# EAGLE schematic DBS (EAGLE 9.6.1)
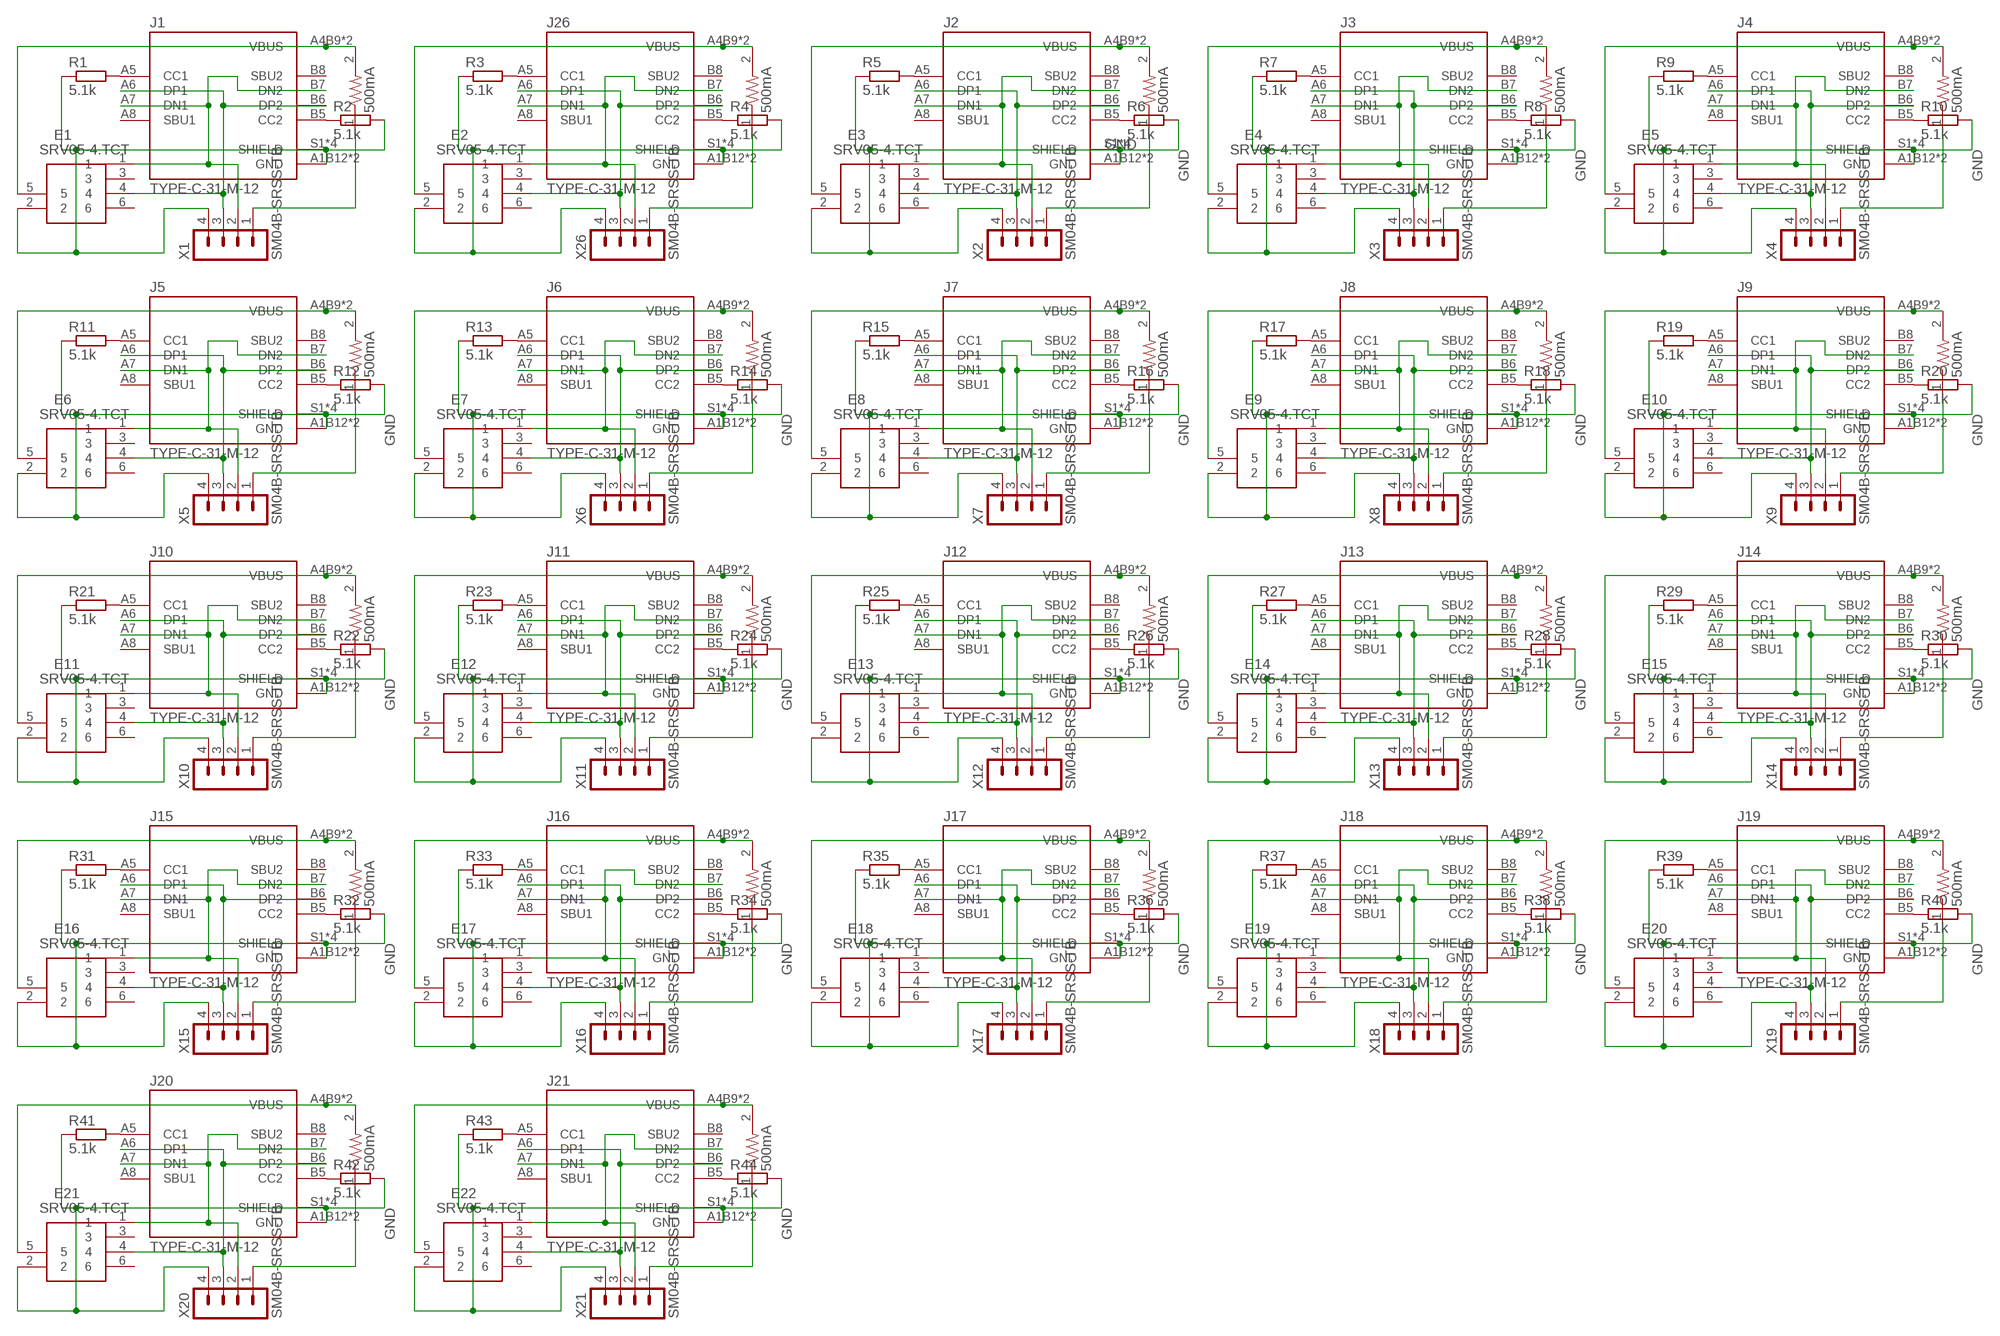
[diagram p0: schematic, sheet 1]

## Parts
E1  SRV05-4.TCT  [SOT95P280X145-6N]
E2  SRV05-4.TCT  [SOT95P280X145-6N]
E3  SRV05-4.TCT  [SOT95P280X145-6N]
E4  SRV05-4.TCT  [SOT95P280X145-6N]
E5  SRV05-4.TCT  [SOT95P280X145-6N]
E6  SRV05-4.TCT  [SOT95P280X145-6N]
E7  SRV05-4.TCT  [SOT95P280X145-6N]
E8  SRV05-4.TCT  [SOT95P280X145-6N]
E9  SRV05-4.TCT  [SOT95P280X145-6N]
E10  SRV05-4.TCT  [SOT95P280X145-6N]
E11  SRV05-4.TCT  [SOT95P280X145-6N]
E12  SRV05-4.TCT  [SOT95P280X145-6N]
E13  SRV05-4.TCT  [SOT95P280X145-6N]
E14  SRV05-4.TCT  [SOT95P280X145-6N]
E15  SRV05-4.TCT  [SOT95P280X145-6N]
E16  SRV05-4.TCT  [SOT95P280X145-6N]
E17  SRV05-4.TCT  [SOT95P280X145-6N]
E18  SRV05-4.TCT  [SOT95P280X145-6N]
E19  SRV05-4.TCT  [SOT95P280X145-6N]
E20  SRV05-4.TCT  [SOT95P280X145-6N]
E21  SRV05-4.TCT  [SOT95P280X145-6N]
E22  SRV05-4.TCT  [SOT95P280X145-6N]
F1  500mA  0ZCJ0075AF2E  [RESC3216X125N]
F2  500mA  0ZCJ0075AF2E  [RESC3216X125N]
F3  500mA  0ZCJ0075AF2E  [RESC3216X125N]
F4  500mA  0ZCJ0075AF2E  [RESC3216X125N]
F5  500mA  0ZCJ0075AF2E  [RESC3216X125N]
F6  500mA  0ZCJ0075AF2E  [RESC3216X125N]
F7  500mA  0ZCJ0075AF2E  [RESC3216X125N]
F8  500mA  0ZCJ0075AF2E  [RESC3216X125N]
F9  500mA  0ZCJ0075AF2E  [RESC3216X125N]
F10  500mA  0ZCJ0075AF2E  [RESC3216X125N]
F11  500mA  0ZCJ0075AF2E  [RESC3216X125N]
F12  500mA  0ZCJ0075AF2E  [RESC3216X125N]
F13  500mA  0ZCJ0075AF2E  [RESC3216X125N]
F14  500mA  0ZCJ0075AF2E  [RESC3216X125N]
F15  500mA  0ZCJ0075AF2E  [RESC3216X125N]
F16  500mA  0ZCJ0075AF2E  [RESC3216X125N]
F17  500mA  0ZCJ0075AF2E  [RESC3216X125N]
F18  500mA  0ZCJ0075AF2E  [RESC3216X125N]
F19  500mA  0ZCJ0075AF2E  [RESC3216X125N]
F20  500mA  0ZCJ0075AF2E  [RESC3216X125N]
F21  500mA  0ZCJ0075AF2E  [RESC3216X125N]
F22  500mA  0ZCJ0075AF2E  [RESC3216X125N]
J1  TYPE-C-31-M-12  [HRO_TYPE-C-31-M-12]
J2  TYPE-C-31-M-12  [HRO_TYPE-C-31-M-12]
J3  TYPE-C-31-M-12  [HRO_TYPE-C-31-M-12]
J4  TYPE-C-31-M-12  [HRO_TYPE-C-31-M-12]
J5  TYPE-C-31-M-12  [HRO_TYPE-C-31-M-12]
J6  TYPE-C-31-M-12  [HRO_TYPE-C-31-M-12]
J7  TYPE-C-31-M-12  [HRO_TYPE-C-31-M-12]
J8  TYPE-C-31-M-12  [HRO_TYPE-C-31-M-12]
J9  TYPE-C-31-M-12  [HRO_TYPE-C-31-M-12]
J10  TYPE-C-31-M-12  [HRO_TYPE-C-31-M-12]
J11  TYPE-C-31-M-12  [HRO_TYPE-C-31-M-12]
J12  TYPE-C-31-M-12  [HRO_TYPE-C-31-M-12]
J13  TYPE-C-31-M-12  [HRO_TYPE-C-31-M-12]
J14  TYPE-C-31-M-12  [HRO_TYPE-C-31-M-12]
J15  TYPE-C-31-M-12  [HRO_TYPE-C-31-M-12]
J16  TYPE-C-31-M-12  [HRO_TYPE-C-31-M-12]
J17  TYPE-C-31-M-12  [HRO_TYPE-C-31-M-12]
J18  TYPE-C-31-M-12  [HRO_TYPE-C-31-M-12]
J19  TYPE-C-31-M-12  [HRO_TYPE-C-31-M-12]
J20  TYPE-C-31-M-12  [HRO_TYPE-C-31-M-12]
J21  TYPE-C-31-M-12  [HRO_TYPE-C-31-M-12]
J26  TYPE-C-31-M-12  [HRO_TYPE-C-31-M-12]
R1  5.1k  RESISTOR-0603  [R0603]
R2  5.1k  RESISTOR-0603  [R0603]
R3  5.1k  RESISTOR-0603  [R0603]
R4  5.1k  RESISTOR-0603  [R0603]
R5  5.1k  RESISTOR-0603  [R0603]
R6  5.1k  RESISTOR-0603  [R0603]
R7  5.1k  RESISTOR-0603  [R0603]
R8  5.1k  RESISTOR-0603  [R0603]
R9  5.1k  RESISTOR-0603  [R0603]
R10  5.1k  RESISTOR-0603  [R0603]
R11  5.1k  RESISTOR-0603  [R0603]
R12  5.1k  RESISTOR-0603  [R0603]
R13  5.1k  RESISTOR-0603  [R0603]
R14  5.1k  RESISTOR-0603  [R0603]
R15  5.1k  RESISTOR-0603  [R0603]
R16  5.1k  RESISTOR-0603  [R0603]
R17  5.1k  RESISTOR-0603  [R0603]
R18  5.1k  RESISTOR-0603  [R0603]
R19  5.1k  RESISTOR-0603  [R0603]
R20  5.1k  RESISTOR-0603  [R0603]
R21  5.1k  RESISTOR-0603  [R0603]
R22  5.1k  RESISTOR-0603  [R0603]
R23  5.1k  RESISTOR-0603  [R0603]
R24  5.1k  RESISTOR-0603  [R0603]
R25  5.1k  RESISTOR-0603  [R0603]
R26  5.1k  RESISTOR-0603  [R0603]
R27  5.1k  RESISTOR-0603  [R0603]
R28  5.1k  RESISTOR-0603  [R0603]
R29  5.1k  RESISTOR-0603  [R0603]
R30  5.1k  RESISTOR-0603  [R0603]
R31  5.1k  RESISTOR-0603  [R0603]
R32  5.1k  RESISTOR-0603  [R0603]
R33  5.1k  RESISTOR-0603  [R0603]
R34  5.1k  RESISTOR-0603  [R0603]
R35  5.1k  RESISTOR-0603  [R0603]
R36  5.1k  RESISTOR-0603  [R0603]
R37  5.1k  RESISTOR-0603  [R0603]
R38  5.1k  RESISTOR-0603  [R0603]
R39  5.1k  RESISTOR-0603  [R0603]
R40  5.1k  RESISTOR-0603  [R0603]
R41  5.1k  RESISTOR-0603  [R0603]
R42  5.1k  RESISTOR-0603  [R0603]
R43  5.1k  RESISTOR-0603  [R0603]
R44  5.1k  RESISTOR-0603  [R0603]
X1  SM04B-SRSS-TB  [SM04B-SRSS-TB]
X2  SM04B-SRSS-TB  [SM04B-SRSS-TB]
X3  SM04B-SRSS-TB  [SM04B-SRSS-TB]
X4  SM04B-SRSS-TB  [SM04B-SRSS-TB]
X5  SM04B-SRSS-TB  [SM04B-SRSS-TB]
X6  SM04B-SRSS-TB  [SM04B-SRSS-TB]
X7  SM04B-SRSS-TB  [SM04B-SRSS-TB]
X8  SM04B-SRSS-TB  [SM04B-SRSS-TB]
X9  SM04B-SRSS-TB  [SM04B-SRSS-TB]
X10  SM04B-SRSS-TB  [SM04B-SRSS-TB]
X11  SM04B-SRSS-TB  [SM04B-SRSS-TB]
X12  SM04B-SRSS-TB  [SM04B-SRSS-TB]
X13  SM04B-SRSS-TB  [SM04B-SRSS-TB]
X14  SM04B-SRSS-TB  [SM04B-SRSS-TB]
X15  SM04B-SRSS-TB  [SM04B-SRSS-TB]
X16  SM04B-SRSS-TB  [SM04B-SRSS-TB]
X17  SM04B-SRSS-TB  [SM04B-SRSS-TB]
X18  SM04B-SRSS-TB  [SM04B-SRSS-TB]
X19  SM04B-SRSS-TB  [SM04B-SRSS-TB]
X20  SM04B-SRSS-TB  [SM04B-SRSS-TB]
X21  SM04B-SRSS-TB  [SM04B-SRSS-TB]
X26  SM04B-SRSS-TB  [SM04B-SRSS-TB]

## Nets
DN1: E1.1 J1.A7(DN1) J1.B7(DN2) X1.2
DN2: E2.1 J26.A7(DN1) J26.B7(DN2) X26.2
DN3: E3.1 J2.A7(DN1) J2.B7(DN2) X2.2
DN4: E4.1 J3.A7(DN1) J3.B7(DN2) X3.2
DN5: E5.1 J4.A7(DN1) J4.B7(DN2) X4.2
DN6: E6.1 J5.A7(DN1) J5.B7(DN2) X5.2
DN7: E7.1 J6.A7(DN1) J6.B7(DN2) X6.2
DN8: E8.1 J7.A7(DN1) J7.B7(DN2) X7.2
DN9: E9.1 J8.A7(DN1) J8.B7(DN2) X8.2
DN10: E10.1 J9.A7(DN1) J9.B7(DN2) X9.2
DN11: E11.1 J10.A7(DN1) J10.B7(DN2) X10.2
DN12: E12.1 J11.A7(DN1) J11.B7(DN2) X11.2
DN13: E13.1 J12.A7(DN1) J12.B7(DN2) X12.2
DN14: E14.1 J13.A7(DN1) J13.B7(DN2) X13.2
DN15: E15.1 J14.A7(DN1) J14.B7(DN2) X14.2
DN16: E16.1 J15.A7(DN1) J15.B7(DN2) X15.2
DN17: E17.1 J16.A7(DN1) J16.B7(DN2) X16.2
DN18: E18.1 J17.A7(DN1) J17.B7(DN2) X17.2
DN19: E19.1 J18.A7(DN1) J18.B7(DN2) X18.2
DN20: E20.1 J19.A7(DN1) J19.B7(DN2) X19.2
DN21: E21.1 J20.A7(DN1) J20.B7(DN2) X20.2
DN22: E22.1 J21.A7(DN1) J21.B7(DN2) X21.2
DP1: E1.4 J1.A6(DP1) J1.B6(DP2) X1.3
DP2: E2.4 J26.A6(DP1) J26.B6(DP2) X26.3
DP3: E3.4 J2.A6(DP1) J2.B6(DP2) X2.3
DP4: E4.4 J3.A6(DP1) J3.B6(DP2) X3.3
DP5: E5.4 J4.A6(DP1) J4.B6(DP2) X4.3
DP6: E6.4 J5.A6(DP1) J5.B6(DP2) X5.3
DP7: E7.4 J6.A6(DP1) J6.B6(DP2) X6.3
DP8: E8.4 J7.A6(DP1) J7.B6(DP2) X7.3
DP9: E9.4 J8.A6(DP1) J8.B6(DP2) X8.3
DP10: E10.4 J9.A6(DP1) J9.B6(DP2) X9.3
DP11: E11.4 J10.A6(DP1) J10.B6(DP2) X10.3
DP12: E12.4 J11.A6(DP1) J11.B6(DP2) X11.3
DP13: E13.4 J12.A6(DP1) J12.B6(DP2) X12.3
DP14: E14.4 J13.A6(DP1) J13.B6(DP2) X13.3
DP15: E15.4 J14.A6(DP1) J14.B6(DP2) X14.3
DP16: E16.4 J15.A6(DP1) J15.B6(DP2) X15.3
DP17: E17.4 J16.A6(DP1) J16.B6(DP2) X16.3
DP18: E18.4 J17.A6(DP1) J17.B6(DP2) X17.3
DP19: E19.4 J18.A6(DP1) J18.B6(DP2) X18.3
DP20: E20.4 J19.A6(DP1) J19.B6(DP2) X19.3
DP21: E21.4 J20.A6(DP1) J20.B6(DP2) X20.3
DP22: E22.4 J21.A6(DP1) J21.B6(DP2) X21.3
GND: E1.2 E2.2 E3.2 E4.2 E5.2 E6.2 E7.2 E8.2 E9.2 E10.2 E11.2 E12.2 E13.2 E14.2 E15.2 E16.2 E17.2 E18.2 E19.2 E20.2 E21.2 E22.2 J1.A1B12(GND) J1.B1A12(GND) J1.S1(SHIELD) J1.S2(SHIELD) J1.S3(SHIELD) J1.S4(SHIELD) J2.A1B12(GND) J2.B1A12(GND) J2.S1(SHIELD) J2.S2(SHIELD) J2.S3(SHIELD) J2.S4(SHIELD) J3.A1B12(GND) J3.B1A12(GND) J3.S1(SHIELD) J3.S2(SHIELD) J3.S3(SHIELD) J3.S4(SHIELD) J4.A1B12(GND) J4.B1A12(GND) J4.S1(SHIELD) J4.S2(SHIELD) J4.S3(SHIELD) J4.S4(SHIELD) J5.A1B12(GND) J5.B1A12(GND) J5.S1(SHIELD) J5.S2(SHIELD) J5.S3(SHIELD) J5.S4(SHIELD) J6.A1B12(GND) J6.B1A12(GND) J6.S1(SHIELD) J6.S2(SHIELD) J6.S3(SHIELD) J6.S4(SHIELD) J7.A1B12(GND) J7.B1A12(GND) J7.S1(SHIELD) J7.S2(SHIELD) J7.S3(SHIELD) J7.S4(SHIELD) J8.A1B12(GND) J8.B1A12(GND) J8.S1(SHIELD) J8.S2(SHIELD) J8.S3(SHIELD) J8.S4(SHIELD) J9.A1B12(GND) J9.B1A12(GND) J9.S1(SHIELD) J9.S2(SHIELD) J9.S3(SHIELD) J9.S4(SHIELD) J10.A1B12(GND) J10.B1A12(GND) J10.S1(SHIELD) J10.S2(SHIELD) J10.S3(SHIELD) J10.S4(SHIELD) J11.A1B12(GND) J11.B1A12(GND) J11.S1(SHIELD) J11.S2(SHIELD) J11.S3(SHIELD) J11.S4(SHIELD) J12.A1B12(GND) J12.B1A12(GND) J12.S1(SHIELD) J12.S2(SHIELD) J12.S3(SHIELD) J12.S4(SHIELD) J13.A1B12(GND) J13.B1A12(GND) J13.S1(SHIELD) J13.S2(SHIELD) J13.S3(SHIELD) J13.S4(SHIELD) J14.A1B12(GND) J14.B1A12(GND) J14.S1(SHIELD) J14.S2(SHIELD) J14.S3(SHIELD) J14.S4(SHIELD) J15.A1B12(GND) J15.B1A12(GND) J15.S1(SHIELD) J15.S2(SHIELD) J15.S3(SHIELD) J15.S4(SHIELD) J16.A1B12(GND) J16.B1A12(GND) J16.S1(SHIELD) J16.S2(SHIELD) J16.S3(SHIELD) J16.S4(SHIELD) J17.A1B12(GND) J17.B1A12(GND) J17.S1(SHIELD) J17.S2(SHIELD) J17.S3(SHIELD) J17.S4(SHIELD) J18.A1B12(GND) J18.B1A12(GND) J18.S1(SHIELD) J18.S2(SHIELD) J18.S3(SHIELD) J18.S4(SHIELD) J19.A1B12(GND) J19.B1A12(GND) J19.S1(SHIELD) J19.S2(SHIELD) J19.S3(SHIELD) J19.S4(SHIELD) J20.A1B12(GND) J20.B1A12(GND) J20.S1(SHIELD) J20.S2(SHIELD) J20.S3(SHIELD) J20.S4(SHIELD) J21.A1B12(GND) J21.B1A12(GND) J21.S1(SHIELD) J21.S2(SHIELD) J21.S3(SHIELD) J21.S4(SHIELD) J26.A1B12(GND) J26.B1A12(GND) J26.S1(SHIELD) J26.S2(SHIELD) J26.S3(SHIELD) J26.S4(SHIELD) R1.1 R2.2 R3.1 R4.2 R5.1 R6.2 R7.1 R8.2 R9.1 R10.2 R11.1 R12.2 R13.1 R14.2 R15.1 R16.2 R17.1 R18.2 R19.1 R20.2 R21.1 R22.2 R23.1 R24.2 R25.1 R26.2 R27.1 R28.2 R29.1 R30.2 R31.1 R32.2 R33.1 R34.2 R35.1 R36.2 R37.1 R38.2 R39.1 R40.2 R41.1 R42.2 R43.1 R44.2 X1.4 X2.4 X3.4 X4.4 X5.4 X6.4 X7.4 X8.4 X9.4 X10.4 X11.4 X12.4 X13.4 X14.4 X15.4 X16.4 X17.4 X18.4 X19.4 X20.4 X21.4 X26.4
N$1: J1.A5(CC1) R1.2
N$2: J1.B5(CC2) R2.1
N$3: E2.5 F2.2 J26.A4B9(VBUS) J26.B4A9(VBUS)
N$4: F2.1 X26.1
N$101: E1.5 F1.2 J1.A4B9(VBUS) J1.B4A9(VBUS)
N$102: J26.A5(CC1) R3.2
N$103: F1.1 X1.1
N$104: J26.B5(CC2) R4.1
N$105: E3.5 F3.2 J2.A4B9(VBUS) J2.B4A9(VBUS)
N$106: F3.1 X2.1
N$107: J2.A5(CC1) R5.2
N$108: J2.B5(CC2) R6.1
N$109: E4.5 F4.2 J3.A4B9(VBUS) J3.B4A9(VBUS)
N$110: F4.1 X3.1
N$111: J3.A5(CC1) R7.2
N$112: J3.B5(CC2) R8.1
N$113: E5.5 F5.2 J4.A4B9(VBUS) J4.B4A9(VBUS)
N$114: F5.1 X4.1
N$115: J4.A5(CC1) R9.2
N$116: J4.B5(CC2) R10.1
N$117: E6.5 F6.2 J5.A4B9(VBUS) J5.B4A9(VBUS)
N$118: F6.1 X5.1
N$119: J5.A5(CC1) R11.2
N$120: J5.B5(CC2) R12.1
N$121: E7.5 F7.2 J6.A4B9(VBUS) J6.B4A9(VBUS)
N$122: F7.1 X6.1
N$123: J6.A5(CC1) R13.2
N$124: J6.B5(CC2) R14.1
N$125: E8.5 F8.2 J7.A4B9(VBUS) J7.B4A9(VBUS)
N$126: F8.1 X7.1
N$127: J7.A5(CC1) R15.2
N$128: J7.B5(CC2) R16.1
N$129: E9.5 F9.2 J8.A4B9(VBUS) J8.B4A9(VBUS)
N$130: F9.1 X8.1
N$131: J8.A5(CC1) R17.2
N$132: J8.B5(CC2) R18.1
N$133: E10.5 F10.2 J9.A4B9(VBUS) J9.B4A9(VBUS)
N$134: F10.1 X9.1
N$135: J9.A5(CC1) R19.2
N$136: J9.B5(CC2) R20.1
N$137: E11.5 F11.2 J10.A4B9(VBUS) J10.B4A9(VBUS)
N$138: F11.1 X10.1
N$139: J10.A5(CC1) R21.2
N$140: J10.B5(CC2) R22.1
N$141: E12.5 F12.2 J11.A4B9(VBUS) J11.B4A9(VBUS)
N$142: F12.1 X11.1
N$143: J11.A5(CC1) R23.2
N$144: J11.B5(CC2) R24.1
N$145: E13.5 F13.2 J12.A4B9(VBUS) J12.B4A9(VBUS)
N$146: F13.1 X12.1
N$147: J12.A5(CC1) R25.2
N$148: J12.B5(CC2) R26.1
N$149: E14.5 F14.2 J13.A4B9(VBUS) J13.B4A9(VBUS)
N$150: F14.1 X13.1
N$151: J13.A5(CC1) R27.2
N$152: J13.B5(CC2) R28.1
N$153: E15.5 F15.2 J14.A4B9(VBUS) J14.B4A9(VBUS)
N$154: F15.1 X14.1
N$155: J14.A5(CC1) R29.2
N$156: J14.B5(CC2) R30.1
N$157: E16.5 F16.2 J15.A4B9(VBUS) J15.B4A9(VBUS)
N$158: F16.1 X15.1
N$159: J15.A5(CC1) R31.2
N$160: J15.B5(CC2) R32.1
N$161: E17.5 F17.2 J16.A4B9(VBUS) J16.B4A9(VBUS)
N$162: F17.1 X16.1
N$163: J16.A5(CC1) R33.2
N$164: J16.B5(CC2) R34.1
N$165: E18.5 F18.2 J17.A4B9(VBUS) J17.B4A9(VBUS)
N$166: F18.1 X17.1
N$167: J17.A5(CC1) R35.2
N$168: J17.B5(CC2) R36.1
N$169: E19.5 F19.2 J18.A4B9(VBUS) J18.B4A9(VBUS)
N$170: F19.1 X18.1
N$171: J18.A5(CC1) R37.2
N$172: J18.B5(CC2) R38.1
N$173: E20.5 F20.2 J19.A4B9(VBUS) J19.B4A9(VBUS)
N$174: F20.1 X19.1
N$175: J19.A5(CC1) R39.2
N$176: J19.B5(CC2) R40.1
N$177: E21.5 F21.2 J20.A4B9(VBUS) J20.B4A9(VBUS)
N$178: F21.1 X20.1
N$179: J20.A5(CC1) R41.2
N$180: J20.B5(CC2) R42.1
N$181: E22.5 F22.2 J21.A4B9(VBUS) J21.B4A9(VBUS)
N$182: F22.1 X21.1
N$183: J21.A5(CC1) R43.2
N$184: J21.B5(CC2) R44.1
Unconnected: E1.3 E1.6 E2.3 E2.6 E3.3 E3.6 E4.3 E4.6 E5.3 E5.6 E6.3 E6.6 E7.3 E7.6 E8.3 E8.6 E9.3 E9.6 E10.3 E10.6 E11.3 E11.6 E12.3 E12.6 E13.3 E13.6 E14.3 E14.6 E15.3 E15.6 E16.3 E16.6 E17.3 E17.6 E18.3 E18.6 E19.3 E19.6 E20.3 E20.6 E21.3 E21.6 E22.3 E22.6 J1.A8(SBU1) J1.B8(SBU2) J2.A8(SBU1) J2.B8(SBU2) J3.A8(SBU1) J3.B8(SBU2) J4.A8(SBU1) J4.B8(SBU2) J5.A8(SBU1) J5.B8(SBU2) J6.A8(SBU1) J6.B8(SBU2) J7.A8(SBU1) J7.B8(SBU2) J8.A8(SBU1) J8.B8(SBU2) J9.A8(SBU1) J9.B8(SBU2) J10.A8(SBU1) J10.B8(SBU2) J11.A8(SBU1) J11.B8(SBU2) J12.A8(SBU1) J12.B8(SBU2) J13.A8(SBU1) J13.B8(SBU2) J14.A8(SBU1) J14.B8(SBU2) J15.A8(SBU1) J15.B8(SBU2) J16.A8(SBU1) J16.B8(SBU2) J17.A8(SBU1) J17.B8(SBU2) J18.A8(SBU1) J18.B8(SBU2) J19.A8(SBU1) J19.B8(SBU2) J20.A8(SBU1) J20.B8(SBU2) J21.A8(SBU1) J21.B8(SBU2) J26.A8(SBU1) J26.B8(SBU2)

## Library data of the parts
E1-E22 = SRV05-4.TCT:SRV05-4.TCT: Semtech SRV05-4.TCT, Uni-Directional TVS Diode Array, 300W, 6-Pin SOT-23 Source: Datasheet <https://componentsearchengine.com/Datasheets/1/SRV05-4.TCT.pdf> Check prices <https://pricing.snapeda.com/parts/SRV05-4.TC/Semtech/view-part?ref=eda>; AVAILABILITY: In Stock; DESCRIPTION: 17.5V Clamp 12A (8/20µs) Ipp Tvs Diode Surface Mount SOT-23-6; MF: Semtech; MP: SRV05-4.TC; PACKAGE: SOT-23-6 Semtech; PRICE: None; PURCHASE-URL: https://pricing.snapeda.com/search/part/SRV05-4.TC/?ref=eda
F1-F22 = fuse:0ZCJ0075AF2E: PTC RESTTBLE 0.75A 16V CHIP 1206 Check prices <https://pricing.snapeda.com/parts/0ZCJ0075AF2E/Bel%20Fuse/view-part?ref=eda>; AVAILABILITY: In Stock; DESCRIPTION: 1206 SMT PPTC | 0.75 Ih | 16V; MF: Bel Fuse; MP: 0ZCJ0075AF2E; PACKAGE: 1206 Bel Fuse; PRICE: None; PURCHASE-URL: https://pricing.snapeda.com/search/part/0ZCJ0075AF2E/?ref=eda
J1-J21 J26 = TYPE-C-31-M-12:TYPE-C-31-M-12: USB Connectors 24 Receptacle 1 8.94*7.3mm RoHS; AVAILABILITY: Unavailable; DESCRIPTION: USB Connectors 24 Receptacle 1 8.94*7.3mm RoHS; MF: HRO Electronics Co., Ltd.; MP: TYPE-C-31-M-12; PACKAGE: Package; PRICE: None
R1-R44 = Components:RESISTOR
X1-X21 X26 = con-JST SH:SM04B-SRSS: JST SH series header 1.00mm pitch disconnectable crimp style connectors, horizontal (side entry type), 4 pins